# EAGLE design EGR326 Practice Board2 (EAGLE 5.02)
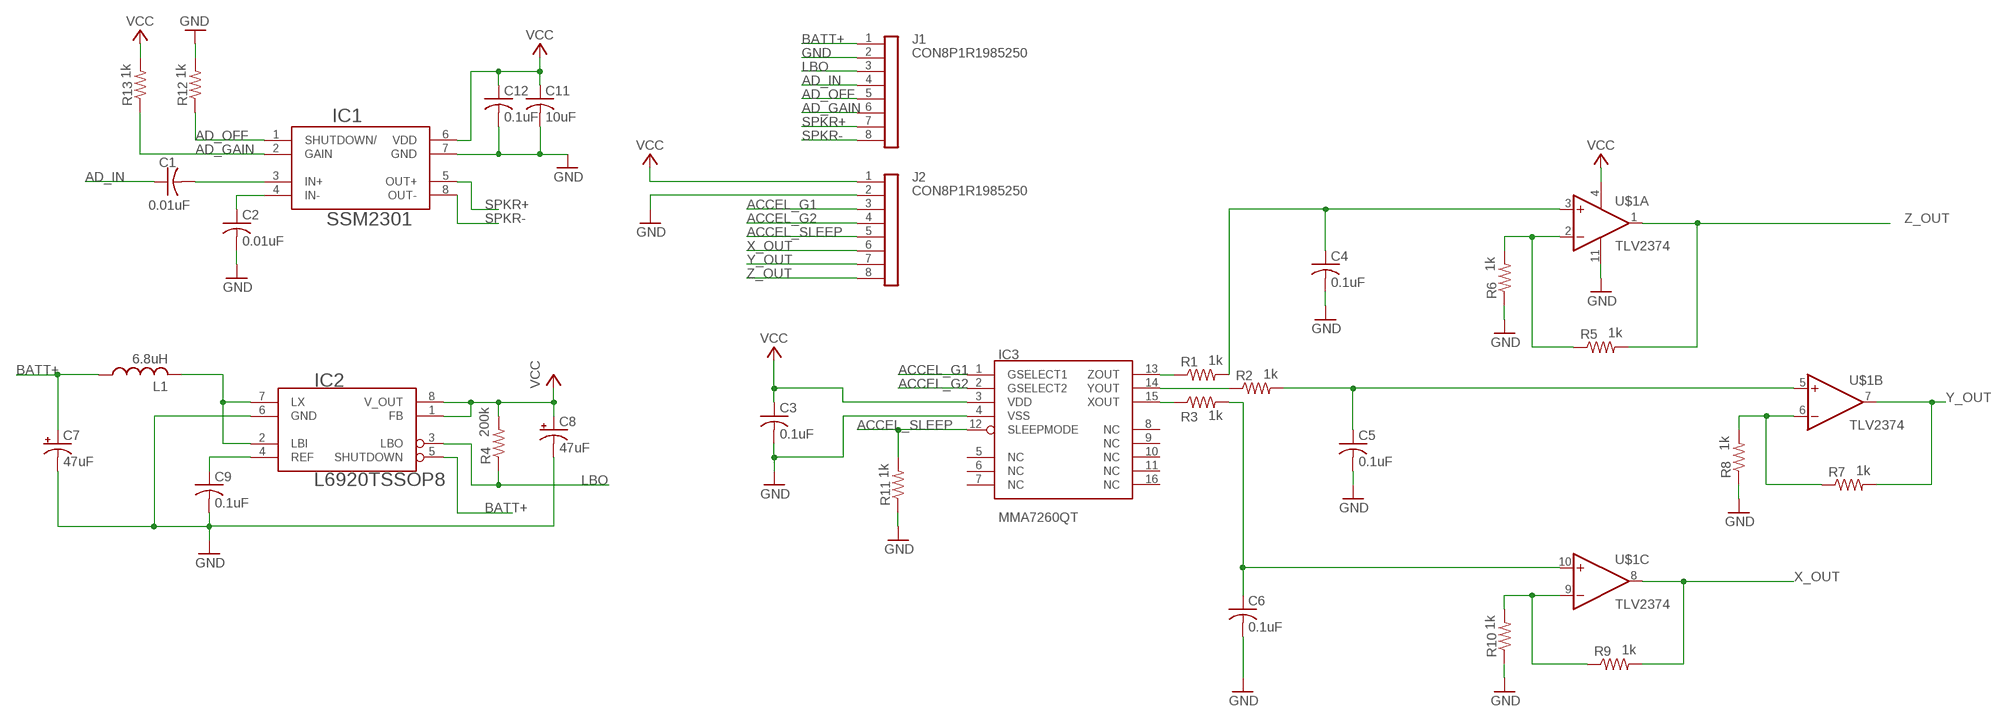
[diagram p0: schematic, sheet 1]

## Parts
C1  0.01uF  C-USC1206  [C1206]
C2  0.01uF  C-USC1206  [C1206]
C3  0.1uF  C-USC1206  [C1206]
C4  0.1uF  C-USC1206  [C1206]
C5  0.1uF  C-USC1206  [C1206]
C6  0.1uF  C-USC1206  [C1206]
C7  47uF  CPOL-USCT3216  [CT3216]
C8  47uF  CPOL-USCT3216  [CT3216]
C9  0.1uF  C-USC1206  [C1206]
C11  10uF  C-USC1206  [C1206]
C12  0.1uF  C-USC1206  [C1206]
IC1  SSM2301  [MSOP08]
IC2  L6920TSSOP8  [TSSOP8]
IC3  MMA7260QT  [QFN-16]
J1  CON8P1R1985250  [1985250]
J2  CON8P1R1985250  [1985250]
L1  6.8uH  L-USB82462G4682M  [B82462G4682M]
R1  1k  R-US_R0805  [R0805]
R2  1k  R-US_R0805  [R0805]
R3  1k  R-US_R0805  [R0805]
R4  200k  R-US_R0805  [R0805]
R5  1k  R-US_R0805  [R0805]
R6  1k  R-US_R0805  [R0805]
R7  1k  R-US_R0805  [R0805]
R8  1k  R-US_R0805  [R0805]
R9  1k  R-US_R0805  [R0805]
R10  1k  R-US_R0805  [R0805]
R11  1k  R-US_R0805  [R0805]
R12  1k  R-US_R0805  [R0805]
R13  1k  R-US_R0805  [R0805]
U$1  TLV2374  [SO14]

## Nets
ACCEL_G1: IC3.1(GSELECT1) J2.3
ACCEL_G2: IC3.2(GSELECT2) J2.4
ACCEL_SLEEP: IC3.12(SLEEPMODE) J2.5 R11.2
AD_GAIN: IC1.2(GAIN) J1.6 R13.1
AD_IN: C1.1 J1.4
AD_OFF: IC1.1(SHUTDOWN/) J1.5 R12.1
BATT+: C7.+ IC2.5(SHUTDOWN) J1.1 L1.P$1
GND: C2.2 C3.2 C4.2 C5.2 C6.2 C7.- C8.- C9.2 C11.2 C12.2 IC1.7(GND) IC2.6(GND) IC3.4(VSS) J1.2 J2.2 R6.1 R8.1 R10.1 R11.1 R12.2 U$1.11(A:V-)
LBO: IC2.3(LBO) J1.3 R4.1
N$1: C1.2 IC1.3(IN+)
N$2: C2.1 IC1.4(IN-)
N$3: C9.1 IC2.4(REF)
N$4: IC2.2(LBI) IC2.7(LX) L1.P$2
N$5: R5.1 R6.2 U$1.2(A:-IN)
N$6: IC3.13(ZOUT) R1.1
N$7: R7.1 R8.2 U$1.6(B:-IN)
N$8: IC3.14(YOUT) R2.1
N$9: IC3.15(XOUT) R3.1
N$10: R9.1 R10.2 U$1.9(C:-IN)
PRE_X_OUT: C6.1 R3.2 U$1.10(C:+IN)
PRE_Y_OUT: C5.1 R2.2 U$1.5(B:+IN)
PRE_Z_OUT: C4.1 R1.2 U$1.3(A:+IN)
SPKR+: IC1.5(OUT+) J1.7
SPKR-: IC1.8(OUT-) J1.8
VCC: C3.1 C8.+ C11.1 C12.1 IC1.6(VDD) IC2.1(FB) IC2.8(V_OUT) IC3.3(VDD) J2.1 R4.2 R13.2 U$1.4(A:V+)
X_OUT: J2.6 R9.2 U$1.8(C:OUT)
Y_OUT: J2.7 R7.2 U$1.7(B:OUT)
Z_OUT: J2.8 R5.2 U$1.1(A:OUT)
Unconnected: IC3.5(NC) IC3.6(NC) IC3.7(NC) IC3.8(NC) IC3.9(NC) IC3.10(NC) IC3.11(NC) IC3.16(NC) U$1.12(D:+IN) U$1.13(D:-IN) U$1.14(D:OUT)

## Library data of the parts
C1-C6 C9 C11 C12 = rcl:C-US: CAPACITOR, American symbol
C7 C8 = rcl:CPOL-US: POLARIZED CAPACITOR, American symbol
IC1 = KylesEagleLib:SSM2301: SSM2301 Class D Audio Amplifier
IC2 = KylesEagleLib:L6920: ST Microelectronics L6920 Boost Converter Boost Converter up to 500mA
IC3 = stewslib:MMA7260QT
J1 J2 = ads4:CON8P1R: 8-pin single-row connector
L1 = KylesEagleLib:L-US: INDUCTOR, American symbol EPOS B82462G4682M
R1-R13 = rcl:R-US_: RESISTOR, American symbol
U$1 = stewslib:TLV2374

## Board
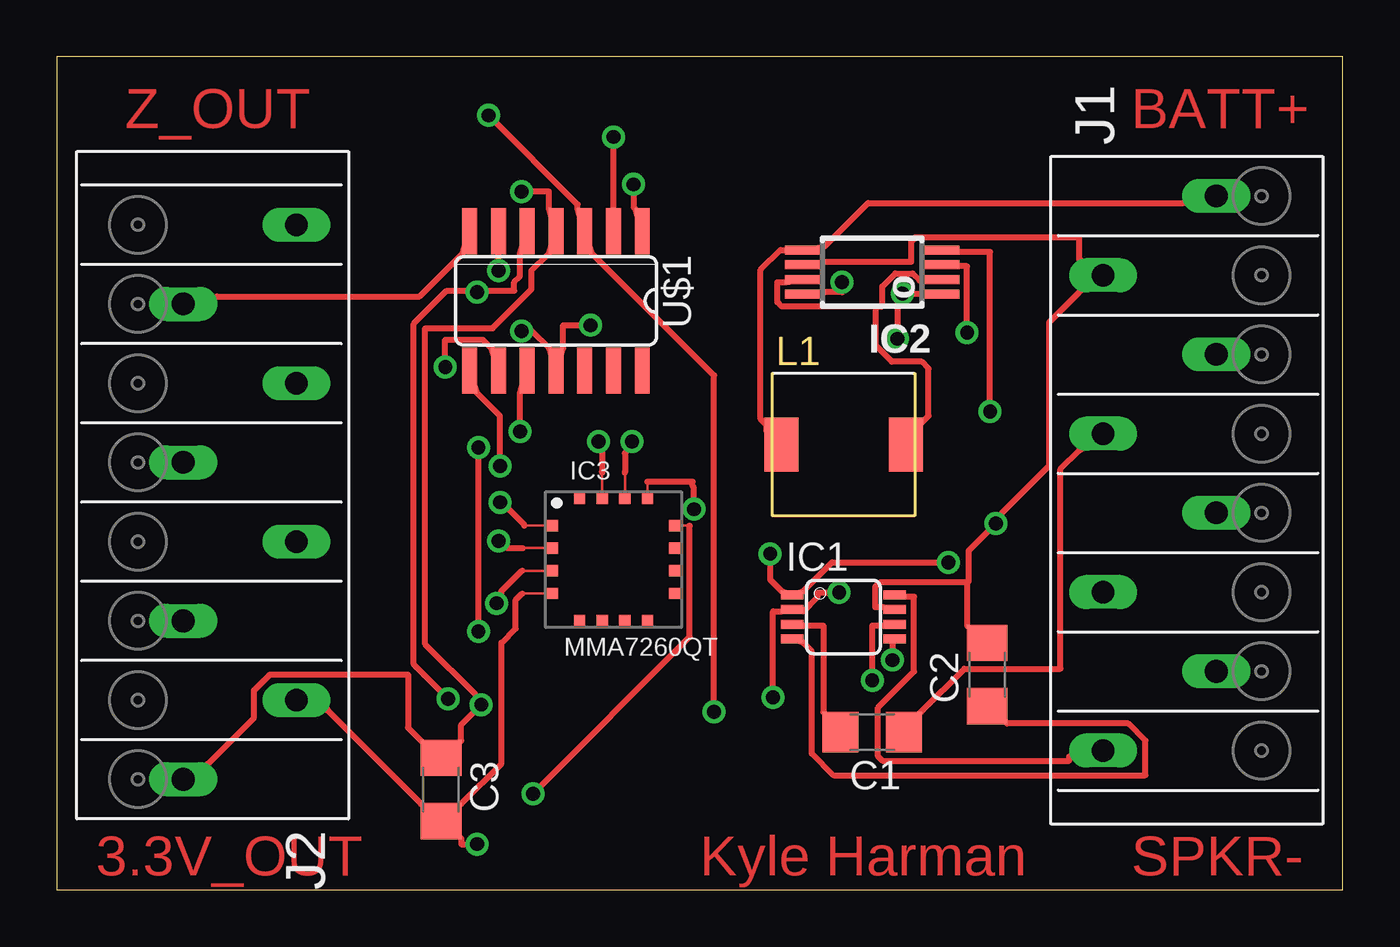
[diagram p1: board, top side]
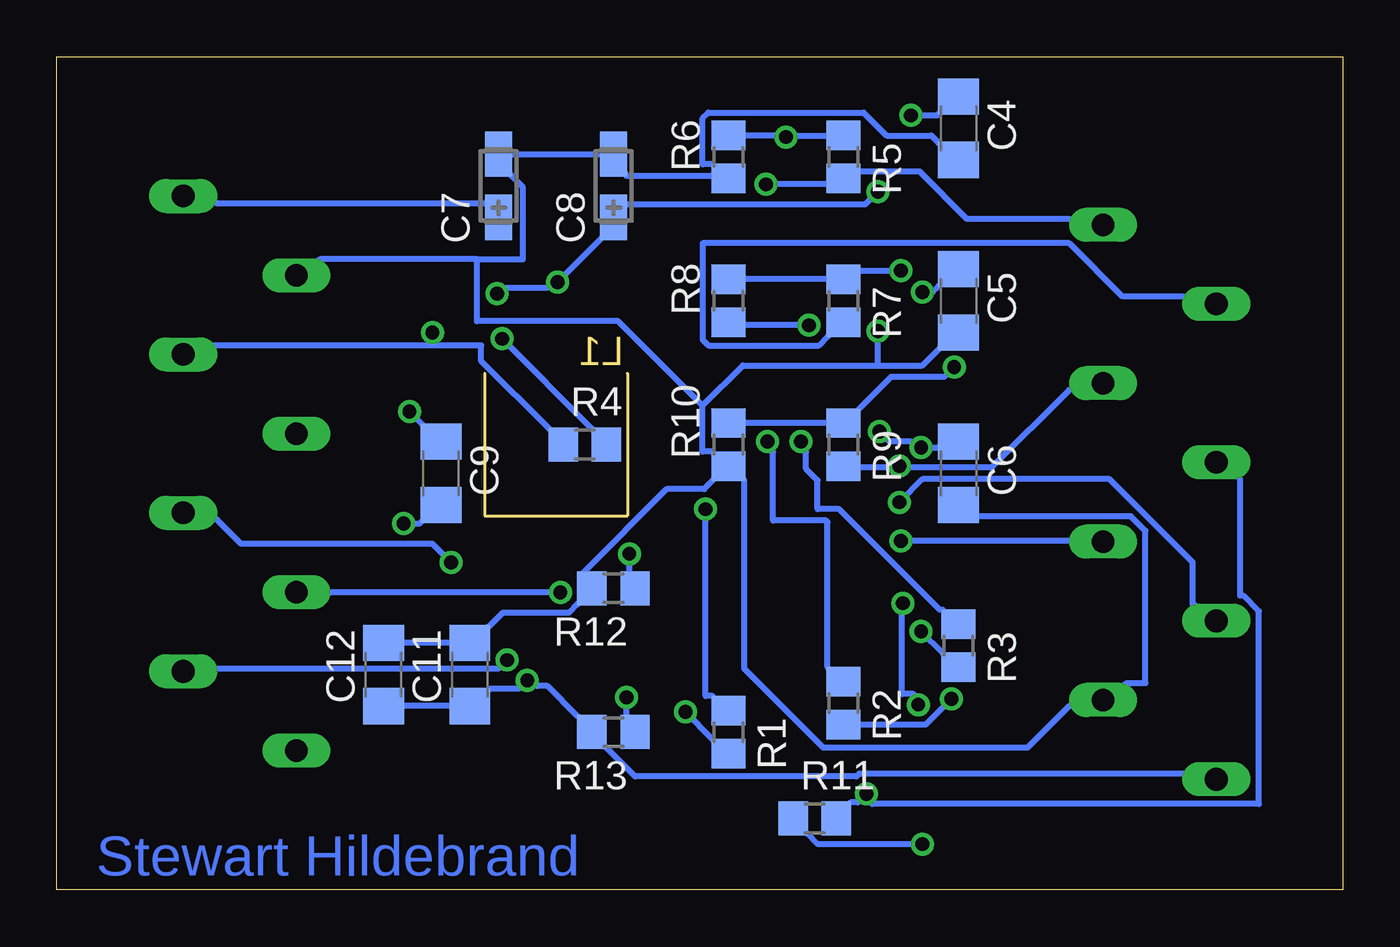
[diagram p2: board, bottom side, seen from below]

Size 56.82 x 36.82 mm. Coordinates in mm from the lower left corner, seen from the top.
Outline: 0,0 56.82,0 56.82,36.82 0,36.82 0,0
Copper layers (1*16): Top 0.035mm / dielectric 1.5mm / Bottom 0.035mm
Design rules "default": minimum track width 10mil, minimum drill 24mil, track to track 8mil, track to pad 8mil, pad to pad 8mil, via to via 8mil, smd to smd 8mil, copper to edge 40mil, drill to drill 8mil, minimum pad ring 10mil, minimum via ring 8mil, stop-mask expansion 4mil, vias tented up to drill 0mil, thermal gap 10mil

### Footprints (pad centres in the part's own frame; a part is rotated, then mirrored left to right if it is on the bottom)
C1206 = smd 1.6 x 1.8: 1 -1.4,0; 2 1.4,0
CT3216 = smd 2 x 1.2: + -1.4,0; - 1.4,0
MSOP08 = smd 1 x 0.4: 1 -2.263,0.976; 2 -2.263,0.326; 3 -2.263,-0.324; 4 -2.263,-0.974; 5 2.262,-0.974; 6 2.262,-0.324; 7 2.262,0.326; 8 2.262,0.976
TSSOP8 = smd 0.395 x 1.78: 1 -0.975,-2.97; 2 -0.325,-2.97; 3 0.325,-2.97; 4 0.975,-2.97; 5 0.975,2.97; 6 0.325,2.97; 7 -0.325,2.97; 8 -0.975,2.97
QFN-16 = smd 0.55 x 0.5: 1 -2.725,1.5; 2 -2.725,0.5; 3 -2.725,-0.5; 4 -2.725,-1.5; 9 2.725,-1.5; 10 2.725,-0.5; 11 2.725,0.5; 12 2.725,1.5 | smd 0.5 x 0.55: 5 -1.5,-2.725; 6 -0.5,-2.725; 7 0.5,-2.725; 8 1.5,-2.725; 13 1.5,2.725; 14 0.5,2.725; 15 -0.5,2.725; 16 -1.5,2.725
1985250 = drill 1 long: 1 12.25,-2.5; 2 8.75,2.5; 3 5.25,-2.5; 4 1.75,2.5; 5 -1.75,-2.5; 6 -5.25,2.5; 7 -8.75,-2.5; 8 -12.25,2.5
B82462G4682M = smd 1.5 x 2.4: P$1 -2.75,0; P$2 2.75,0
R0805 = smd 1.3 x 1.5: 1 -0.95,0; 2 0.95,0
SO14 = smd 0.66 x 2.032: 1 -3.81,-3.073; 2 -2.54,-3.073; 3 -1.27,-3.073; 4 0,-3.073; 5 1.27,-3.073; 6 2.54,-3.073; 7 3.81,-3.073; 8 3.81,3.073; 9 2.54,3.073; 10 1.27,3.073; 11 0,3.073; 12 -1.27,3.073; 13 -2.54,3.073; 14 -3.81,3.073

### Placement (x,y rotation side)
C1  36.03,6.98 180 top
C2  41.11,9.52 90 top
C3  16.98,4.44 270 top
C4  16.98,33.65 270 bottom
C5  16.98,26.03 270 bottom
C6  16.98,18.41 270 bottom
C7  37.3,31.11 90 bottom
C8  32.22,31.11 90 bottom
C9  39.84,18.41 270 bottom
C11  38.57,9.52 90 bottom
C12  42.38,9.52 90 bottom
IC1  34.76,12.06 0 top
IC2  36.03,27.3 90 top
IC3  24.6,14.6 0 top
J1  48.73,18.41 90 top
J2  8.09,17.14 270 top
L1  34.76,19.68 0 top
R1  27.14,6.98 270 bottom
R2  22.06,8.25 270 bottom
R3  16.98,10.79 270 bottom
R4  33.49,19.68 0 bottom
R5  22.06,32.38 270 bottom
R6  27.14,32.38 90 bottom
R7  22.06,26.03 270 bottom
R8  27.14,26.03 90 bottom
R9  22.06,19.68 270 bottom
R10  27.14,19.68 90 bottom
R11  23.33,3.17 0 bottom
R12  32.22,13.33 180 bottom
R13  32.22,6.98 180 bottom
U$1  22.06,26.03 180 top

### Tracks (layer width: path | path; a pad name or v marks a point on that pad's centre or on a via)
ACCEL_G1  (via drill 0.61)
  Top 0.1: 20.65,16.1 20.66,16.1 IC3.1
  Top 0.254: 20.66,16.1 20.66,16.12 19.96,16.82 v19.6,17.13
  Bottom 0.254: v19.6,17.13 18.57,18.16 10.31,18.16 6.63,14.47 6.63,12.63 J2.3
ACCEL_G2  (via drill 0.61)
  Top 0.1: 20.59,15.1 20.6,15.1 IC3.2
  Top 0.254: 20.6,15.1 20.6,15.11 19.9,15.11 v19.52,15.43
  Bottom 0.254: v19.52,15.43 12.09,15.43 J2.4
ACCEL_SLEEP  (via drill 0.61)
  Top 0.1: IC3.12 27.96,16.1 28.05,16.1
  Top 0.254: v21.04,4.25 27.96,11.17 27.96,16.07 27.95,16.09 27.96,16.1
  Bottom 0.254: R11.2 21.74,3.87 21.42,3.87 v21.04,4.25 20.79,3.81 3.71,3.81 3.71,12.31 4.41,13.01 4.53,13.01 4.53,18.16 J2.5
AD_GAIN  (via drill 0.61)
  Top 0.254: v31.65,8.5 31.65,12.31 32.03,12.31 IC1.2 32.98,12.31 33.62,12.95 33.62,13.14 v34.57,13.14
  Bottom 0.254: v31.65,8.5 31.65,7.68 R13.1 | v34.57,13.14 44.73,13.14 J1.6
AD_IN
  Top 0.254: C1.1 38.19,7.87 40.09,9.77 44.35,9.77 44.35,18.6 45.17,19.43 J1.4
AD_OFF  (via drill 0.61)
  Top 0.254: v31.52,14.85 31.52,13.71 32.03,13.2 IC1.1 32.98,13.2 34.25,14.47 v39.39,14.47
  Bottom 0.254: v31.52,14.85 31.52,14.03 R12.1 | v39.39,14.47 40.22,15.3 48.67,15.3 49.75,16.38 J1.5
BATT+
  Top 0.254: J1.1 49.75,30.35 35.84,30.35 33.94,28.44 IC2.5 31.98,28.27 31.1,27.4 31.1,20.8 31.36,20.54 31.36,20.29 32.01,19.64 | 32.01,19.64 32.02,19.63 | 32.01,19.64 L1.P$1
  Bottom 0.254: C7.+ 37.87,30.35 49.75,30.35 J1.1
GND  (via drill 0.61)
  Top 0.1: 20.58,13.1 IC3.4
  Top 0.254: 40.22,13.58 36.35,13.58 36.16,13.39 36.16,12.5 36.54,12.5 IC1.7 | 40.22,13.58 40.22,11.68 C2.2 | 40.22,13.58 40.28,13.65 40.28,14.98 v41.49,16.19 41.74,16.63 43.84,18.73 43.84,25.08 45.17,26.41 J1.2 45.17,27.87 45.17,28.82 37.94,28.82 37.74,28.63 37.74,27.74 33.94,27.74 IC2.6 | C3.2 17.87,3.81 19.65,5.58 19.65,10.92 20.28,11.55 20.28,12.82 20.54,13.08 20.58,13.1 | v18.57,2.03 17.87,2.03 17.87,2.28 C3.2 | C3.2 16.09,3.81 11.96,7.93 11.96,8 J2.2 | v23.58,24.95 22.38,24.95 22.38,23.93 U$1.11 21.74,23.93 20.98,24.7 v20.54,24.7
  Bottom 0.254: C4.2 17.87,33.02 18.19,33.33 20.15,33.33 21.17,34.35 28.03,34.35 28.28,34.09 28.28,32.06 27.84,32.06 R6.1 27.84,31.55 31.65,31.55 C8.- 32.79,32.51 36.73,32.51 C7.- 36.73,31.55 36.22,31.05 36.22,27.87 38.25,27.87 | v41.49,16.19 40.79,16.19 40.73,16.25 C9.2 | 38.25,27.87 45.17,27.87 J1.2 | v18.57,2.03 23.2,2.03 23.65,2.47 R11.1 | C6.2 16.09,16.5 9.36,16.5 8.73,15.87 8.73,9.14 9.55,9.14 J2.2 12.09,8.12 13.93,6.28 22.95,6.28 26.44,9.77 26.44,18.09 R10.1 | v23.58,24.95 26.44,24.95 R8.1 | C12.2 41.49,10.92 39.46,10.92 C11.2 37.68,11.68 37.11,12.25 34.19,12.25 33.81,12.63 R12.2 33.55,14.03 29.87,17.71 28.22,17.71 27.84,18.09 R10.1 | 20.54,23.17 26.5,23.17 28.28,21.39 | 20.54,23.17 18.57,23.17 17.87,23.87 C5.2 | 28.28,21.39 28.28,19.36 27.84,19.36 R10.1 | 20.54,23.17 v20.54,24.7 | 38.25,27.87 38.25,25.13 32.02,25.13 28.28,21.39
LBO  (via drill 0.61)
  Top 0.254: v40.22,24.63 40.22,27.55 39.84,27.55 IC2.3
  Bottom 0.254: 40.22,24.06 49.87,24.06 J1.3 | 40.22,24.06 38.06,24.06 38.06,23.36 35.08,20.38 R4.1 | 40.22,24.06 v40.22,24.63
N$1
  Top 0.254: IC1.3 32.98,11.68 33.87,11.68 33.87,7.87 C1.2
N$2
  Top 0.254: IC1.4 32.98,10.92 33.36,10.54 33.36,6.03 34.32,5.08 48.09,5.08 48.09,6.6 47.33,7.36 42,7.36 C2.1
N$3  (via drill 0.61)
  Top 0.254: v41.24,21.14 41.24,28.19 39.84,28.19 IC2.4
  Bottom 0.254: v41.24,21.14 40.67,20.57 C9.1
N$4
  Top 0.254: 36.18,25.78 32.03,25.78 31.84,25.97 31.84,26.86 32.22,26.86 IC2.7 | IC2.2 38.13,26.92 37.81,27.24 37.05,27.24 36.48,26.66 36.48,25.78 36.18,25.78 | 36.18,25.78 36.18,24.05 36.89,23.34 38.21,23.34 38.52,23.03 38.52,20.95 38.11,20.54 38.11,20.39 37.51,19.79 L1.P$2
N$5  (via drill 0.61)
  Top 0.254: U$1.2 v24.6,33.27
  Bottom 0.254: 24.6,33.33 26.44,33.33 R6.2 | 24.6,33.33 22.76,33.33 R5.1 | v24.6,33.27 24.6,33.33
N$6  (via drill 0.61)
  Top 0.1: 26.1,18.03 IC3.13
  Top 0.254: v28.16,16.82 28.16,17.77 28.09,17.84 28.09,18.03 26.1,18.03
  Bottom 0.254: v28.16,16.82 28.16,8.57 27.84,8.57 R1.1
N$7  (via drill 0.61)
  Top 0.254: v19.52,27.36 U$1.6
  Bottom 0.254: R8.2 26.44,26.98 22.76,26.98 R7.1 21.36,27.36 v19.52,27.36
N$8  (via drill 0.61)
  Top 0.1: 25.1,18.44 IC3.14
  Top 0.254: v25.41,19.82 25.17,19.36 25.11,19.3 25.11,18.47 25.1,18.44
  Bottom 0.254: R2.1 22.76,9.84 22.76,16.25 22.82,16.31 25.17,16.31 25.17,19.36 v25.41,19.82
N$9  (via drill 0.61)
  Top 0.1: 24.1,18.44 IC3.15
  Top 0.254: v23.94,19.81 24.09,19.36 24.09,18.47 24.1,18.44
  Bottom 0.254: R3.1 17.68,12.38 17.8,12.38 22.25,16.82 23.2,16.82 23.2,18.09 23.71,18.6 23.71,19.36 v23.94,19.81
N$10  (via drill 0.61)
  Top 0.254: v17.17,23.11 17.17,24.32 18.82,24.32 19.2,23.93 U$1.9
  Bottom 0.254: R10.2 26.44,20.63 22.76,20.63 R9.1 21.36,21.27 19.96,22.66 17.61,22.66 v17.17,23.11
PRE_X_OUT  (via drill 0.61)
  Top 0.254: v18.63,11.42 v18.63,19.55 | v20.47,20.25 20.47,21.97 U$1.10
  Bottom 0.254: v18.63,11.42 17.68,10.47 R3.2 | C6.1 17.87,19.55 v18.63,19.55 19.07,19.81 20.03,19.81 v20.47,20.25
PRE_Y_OUT  (via drill 0.61)
  Top 0.254: v17.3,8.44 15.77,9.96 15.77,25.01 17.23,26.47 18.57,26.47 | 18.57,26.47 20.22,26.47 20.22,26.86 20.47,27.11 20.47,28.12 U$1.5 | 18.57,26.47 v18.57,26.41
  Bottom 0.254: v17.3,8.44 18.44,7.3 21.36,7.3 R2.2 | v18.57,26.41 18.12,26.41 17.87,26.66 C5.1
PRE_Z_OUT  (via drill 0.61)
  Top 0.254: v29.04,7.87 29.04,22.73 23.65,28.12 U$1.3 23.01,30.09 23.01,30.28 v19.07,34.22
  Bottom 0.254: v29.04,7.87 27.84,6.66 R1.2 | v19.07,34.22 17.93,34.22 17.87,34.28 C4.1
SPKR+  (via drill 0.61)
  Top 0.254: v36.92,10.15 36.92,10.92 IC1.5
  Bottom 0.254: v36.92,10.15 37.3,9.77 49.75,9.77 J1.7
SPKR-
  Top 0.254: IC1.8 37.49,12.95 37.87,12.95 37.87,9.65 36.28,8.06 36.28,5.9 36.48,5.71 44.73,5.71 44.73,5.9 J1.8
VCC  (via drill 0.61)
  Top 0.1: 20.58,14.1 IC3.3
  Top 0.254: v36.03,9.27 36.03,11.68 36.54,11.68 IC1.6 | v34.7,26.86 34.7,26.41 33.94,26.41 IC2.8 | IC2.1 38.13,26.35 v37.36,26.35 37.15,25.88 v37.15,24.35 | J2.1 6.69,5.58 8.73,7.62 8.73,8.82 9.42,9.52 15.52,9.52 15.52,7.17 16.09,6.6 C3.1 17.87,6.6 17.87,7.3 v18.76,8.19 18.5,8.63 16.28,10.85 16.28,24.82 19.27,24.82 20.98,26.54 20.98,27.36 21.74,28.12 U$1.4 21.74,30.09 21.74,30.86 v20.54,30.86 | 20.58,14.1 20.54,14.09 19.65,13.2 19.65,13.14 v19.43,12.67
  Bottom 0.254: C12.1 41.49,8.12 39.46,8.12 C11.1 37.68,8.88 36.41,8.88 v36.03,9.27 35.59,9.01 35.14,9.01 33.81,7.68 R13.2 32.54,6.28 31.27,5.01 21.49,5.01 21.36,5.14 7.07,5.14 J2.1 | v37.36,26.35 37.11,26.6 35.14,26.6 v34.7,26.86 32.79,28.76 C8.+ 31.65,30.28 21.11,30.28 v20.54,30.86 | v37.15,24.35 33.19,20.39 R4.2 | v19.43,12.67 19.47,12.72 19.47,8.66 18.96,8.66 v18.76,8.19
X_OUT  (via drill 0.61)
  Top 0.254: v19.58,18.73 19.58,20.95 18.57,21.97 U$1.8
  Bottom 0.254: 19.58,18.66 15.52,18.66 12.09,22.09 J2.6 | 19.58,18.66 21.36,18.66 R9.2 | 19.58,18.66 v19.58,18.73
Y_OUT
  Top 0.254: U$1.7 17.93,28.12 16.03,26.22 7.07,26.22 J2.7
  Bottom 0.254: R7.2 22.76,24.44 23.14,24.06 28.03,24.06 28.28,24.32 28.28,28.57 12.09,28.57 9.74,26.22 7.07,26.22 J2.7
Z_OUT  (via drill 0.61)
  Top 0.254: v25.49,31.17 25.49,30.16 25.55,30.09 U$1.1
  Bottom 0.254: J2.8 12.09,29.65 16.6,29.65 18.69,31.74 21.36,31.74 R5.2 22.76,31.17 v25.49,31.17

### Text on the board
Top: Z_OUT | BATT+ | 3.3V_OUT | Kyle Harman | SPKR-
Bottom: Stewart Hildebrand